# EAGLE design rat2b (EAGLE 7.5.0)
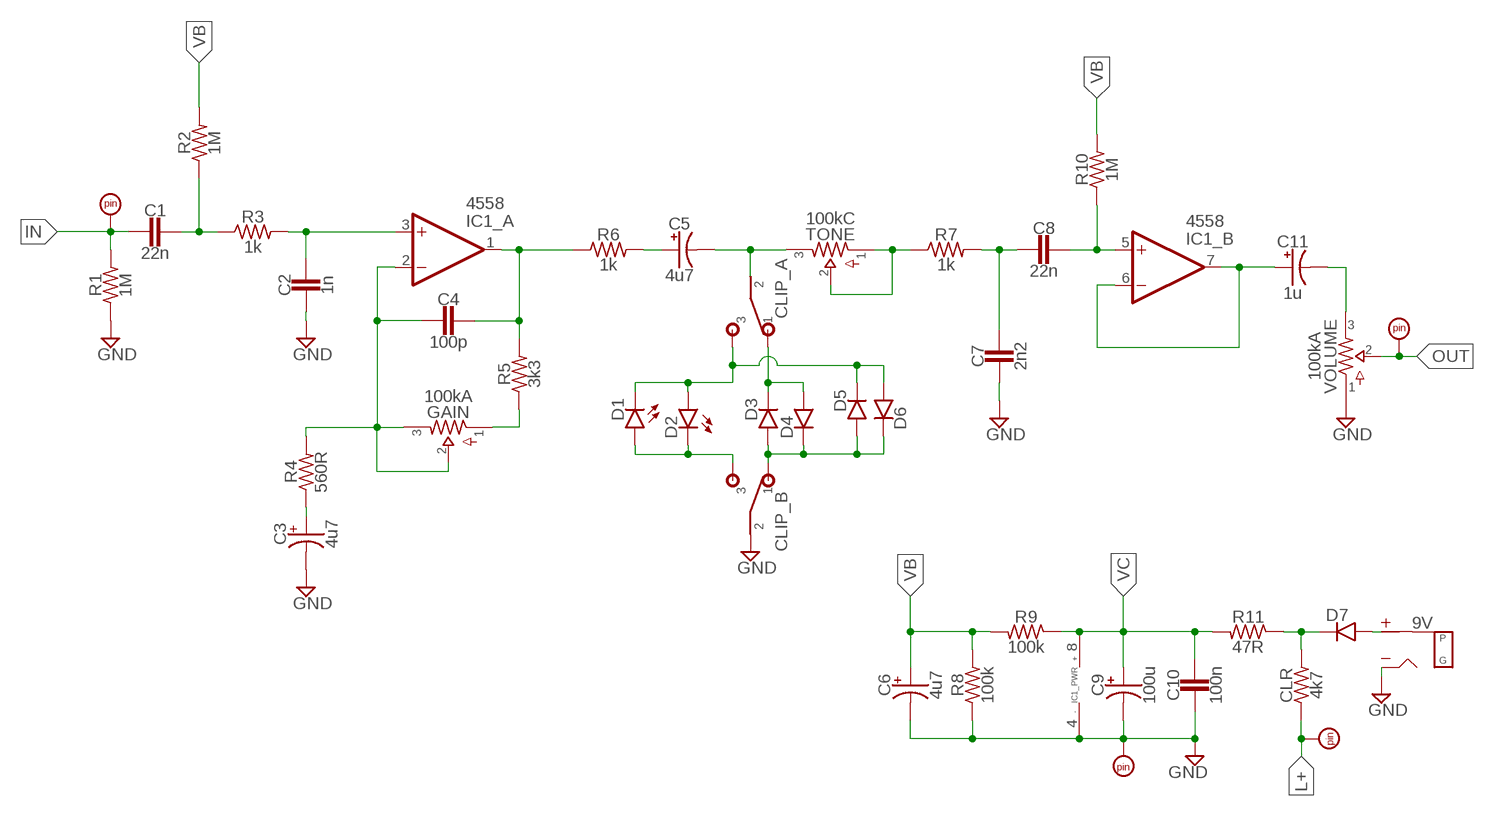
[diagram p0: schematic, sheet 1]

## Parts
9V  DC_MONO  [DC]
C1  22n  CER/FILM2  [050X030_025_2]
C2  1n  CER/FILM2  [050X030_025_2]
C3  4u7  0501  [050_020_1]
C4  100p  CER/FILM2  [050X030_025_2]
C5  4u7  0501  [050_020_1]
C6  4u7  0501  [050_020_1]
C7  2n2  CER/FILM2  [050X030_025_2]
C8  22n  CER/FILM2  [050X030_025_2]
C9  100u  0501  [050_020_1]
C10  100n  CER/FILM2  [050X030_025_2]
C11  1u  0501  [050_020_1]
CLIP  DPDTPCB  [DPDT2_PCB]
CLR  4k7  R_.3B  [R0207/3]
D1  LEDB  [3MM_B]
D2  LEDB  [3MM_B]
D3  DO35.3  [DO35-3]
D4  DO35.3  [DO35-3]
D5  DO35.2  [DO35-2]
D6  DO35.2  [DO35-2]
D7  DO41.3  [DO41-3]
GAIN  100kA  POTS16MM  [16MM]
GND  PADRND  [ROUND]
IC1  4558  DUALTH  [DIL08]
IN  PADSQR  [SQUARE]
LED  PADSQR  [SQUARE]
OUT  PADSQR  [SQUARE]
R1  1M  R_.3B  [R0207/3]
R2  1M  R_.3B  [R0207/3]
R3  1k  R_.3B  [R0207/3]
R4  560R  R_.3B  [R0207/3]
R5  3k3  R_.3B  [R0207/3]
R6  1k  R_.3B  [R0207/3]
R7  1k  R_.3B  [R0207/3]
R8  100k  R_.3B  [R0207/3]
R9  100k  R_.3B  [R0207/3]
R10  1M  R_.3B  [R0207/3]
R11  47R  R_.3B  [R0207/3]
TONE  100kC  POTS16MM  [16MM]
VOLUME  100kA  POTS16MM  [16MM]

## Nets
GND: 9V.S(SLEEVE) C2.2 C3.- C6.- C7.2 C9.- C10.2 CLIP.B2 GND.1 IC1.4(_PWR:V-) R1.1 R8.1 VOLUME.1
IN: C1.2 IN.1 R1.2
L+: CLR.1 CLR.2 D7.C LED.1 R11.1
N$2: C1.1 R2.1 R3.1
N$4: C2.1 IC1.3(_A:+IN) R3.2
N$5: GAIN.1 R5.1
N$6: C4.1 IC1.1(_A:OUT) R5.2 R6.1
N$7: C5.+ R6.2
N$8: C5.- CLIP.A2 TONE.3
N$9: R7.1 TONE.1 TONE.2
N$10: C7.1 C8.2 R7.2
N$11: C8.1 IC1.5(_B:+IN) R10.1
N$12: CLIP.A1 D3.C D4.A
N$13: C11.- VOLUME.3
N$14: CLIP.B1 D3.A D4.C D5.A D6.C
N$15: C4.2 GAIN.2 GAIN.3 IC1.2(_A:-IN) R4.2
N$16: C11.+ IC1.6(_B:-IN) IC1.7(_B:OUT)
N$18: C3.+ R4.1
N$19: 9V.T(TIP) D7.A
N$21: CLIP.A3 D1.K(C) D2.A D5.C D6.A
N$24: CLIP.B3 D1.A D2.K(C)
OUT: OUT.1 VOLUME.2
VB: C6.+ R2.2 R8.2 R9.2 R10.2
VC: C9.+ C10.1 IC1.8(_PWR:V+) R9.1 R11.2

## Library data of the parts
9V = jacks:DC_MONO
C1 C2 C4 C7 C8 C10 = capacitors-film:CER/FILM: 47 - 120pF Xicon Ceramic Disc 2.5mm lead spacing
C3 C5 C6 C9 C11 = capacitors-elec:050: 0.22 - 100uF Xicon values at Mouser.com: 10V: 10 - 100uF; 16V: 2.2 - 47uF; 25V: 0.47 - 47uF; 50V: 0.22 - 22uF
CLIP = switches:DPDT
CLR R1-R11 = resistors:R_
D1 D2 = diodes:LED
D3-D6 = diodes:DO35: DO-35 Package Diodes: 1N914
D7 = diodes:DO41: DO-41 Package Diodes: 1N4001 - 1N40019 Zener Diodes: 1N4728 - 1N4764
GAIN TONE VOLUME = potentiometers:POTS
GND IN LED OUT = supply pins:PAD
IC1 = integrated circuits:DUAL: OP AMP

## Board
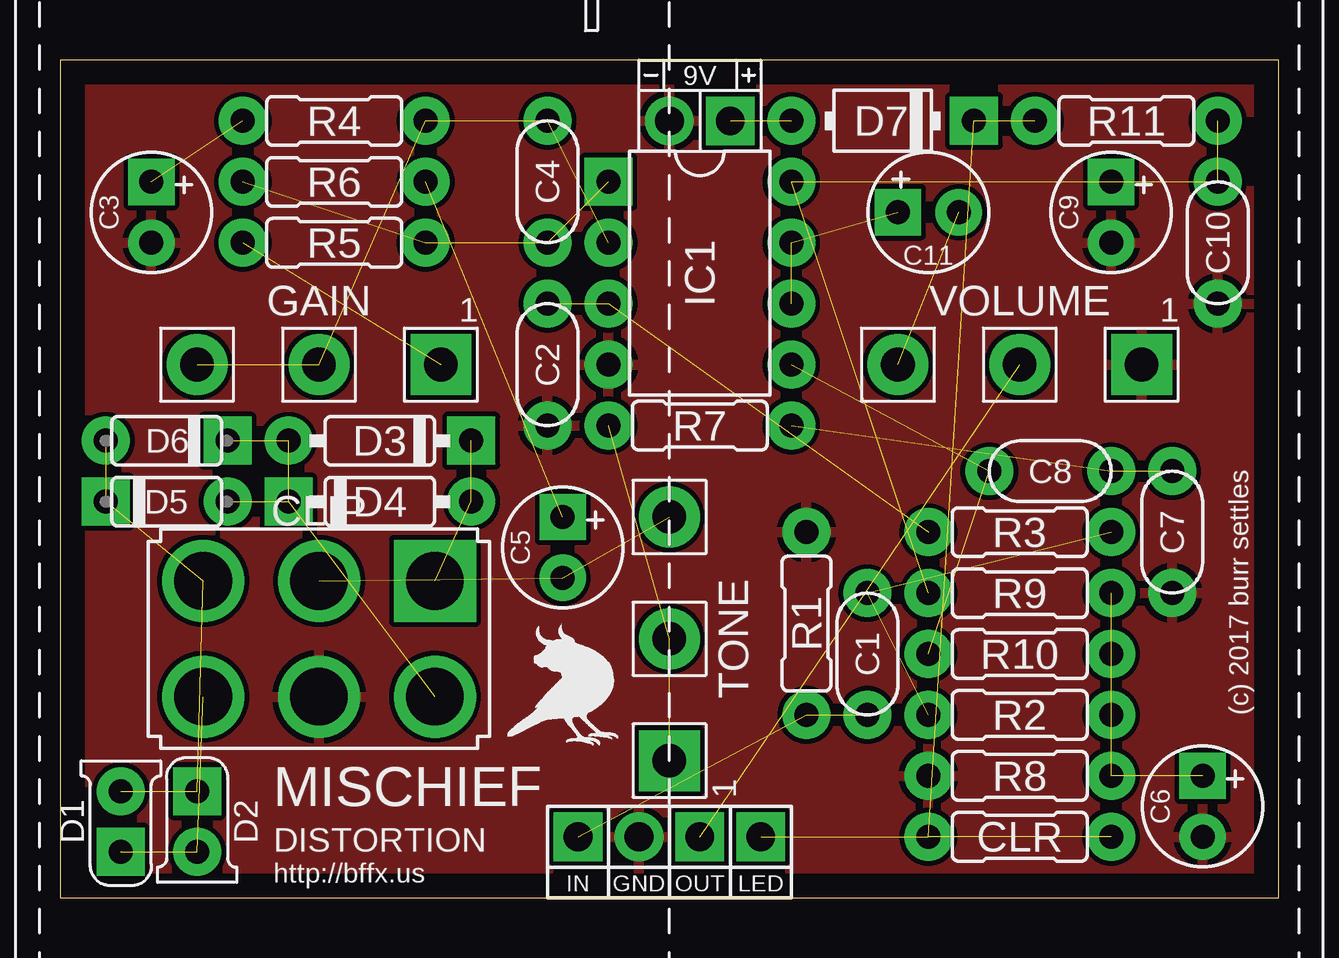
[diagram p1: board, top side]
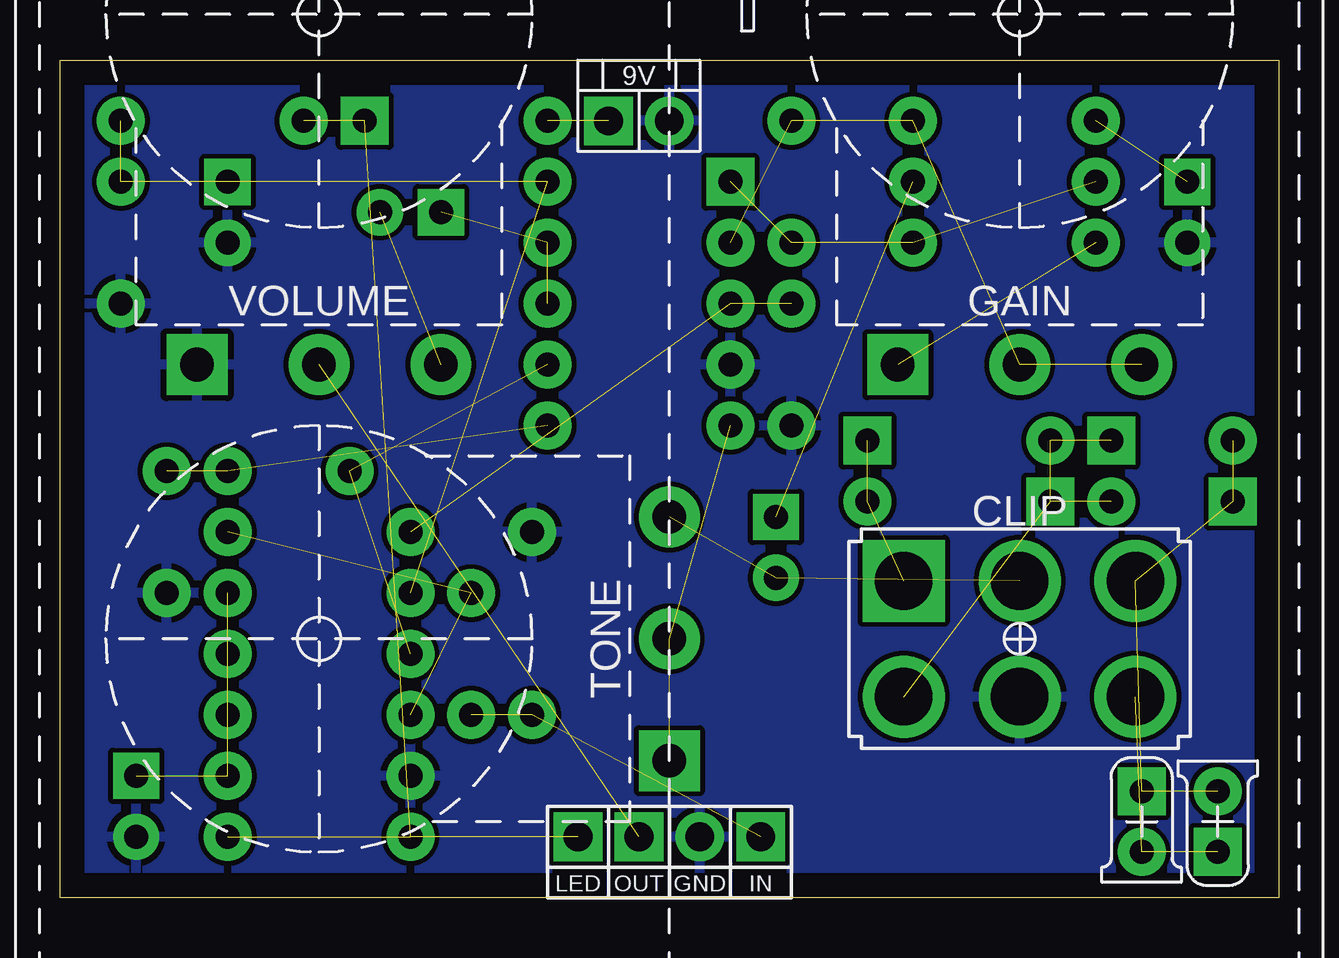
[diagram p2: board, bottom side, seen from below]

Size 50.8 x 34.92 mm. Coordinates in mm from the lower left corner, seen from the top.
Outline: 0,0 50.8,0 50.8,34.92 0,34.91 0,0
Copper layers (1*16): Top 0.035mm / dielectric 1.5mm / Bottom 0.035mm
Design rules "default": minimum track width 10mil, minimum drill 24mil, track to track 8mil, track to pad 8mil, pad to pad 8mil, via to via 8mil, smd to smd 8mil, copper to edge 40mil, drill to drill 8mil, minimum pad ring 10mil, minimum via ring 8mil, stop-mask expansion 4mil, vias tented up to drill 0mil, thermal gap 10mil

### Footprints (pad centres in the part's own frame; a part is rotated, then mirrored left to right if it is on the bottom)
DC = drill 1.2 pad 2.032: S -1.27,0 | drill 1.2 pad 2.032 square: T 1.27,0
050X030_025_2 = drill 1 pad 2: 1 -2.54,0; 2 2.54,0
050_020_1 = drill 1 pad 1.93 square: + -1.27,0 | drill 1 pad 1.93: - 1.27,0
DPDT2_PCB = drill 2.4 square: A1 -2.413,4.834 | drill 2.4: A2 -2.413,0.004; A3 -2.413,-4.826; B1 2.417,4.834; B2 2.417,0.004; B3 2.417,-4.826
R0207/3 = drill 1 pad 2: 1 -3.81,0; 2 3.81,0
3MM_B = drill 1 pad 2 square: A -1.27,0 | drill 1 pad 2: K 1.27,0
DO35-3 = drill 1 pad 2: A 3.81,0 | drill 1 pad 2 square: C -3.81,0
DO35-2 = drill 1 pad 2: A 2.54,0 | drill 1 pad 2 square: C -2.54,0
DO41-3 = drill 1 pad 2: A 3.81,0 | drill 1 pad 2 square: C -3.81,0
16MM = drill 1.4 pad 2.54 square: 1 5.08,0 | drill 1.4 pad 2.54: 2 0,0; 3 -5.08,0
ROUND = drill 1.2 pad 2.032: 1 0,0
DIL08 = drill 1 pad 2 square: 1 -3.81,-3.81 | drill 1 pad 2: 2 -1.27,-3.81; 3 1.27,-3.81; 4 3.81,-3.81; 5 3.81,3.81; 6 1.27,3.81; 7 -1.27,3.81; 8 -3.81,3.81
SQUARE = drill 1.2 pad 2.032 square: 1 0,0

### Placement (x,y rotation side)
9V  26.67,32.38 0 top
C1  33.66,10.16 270 top
C2  20.32,22.23 270 top
C3  3.81,28.57 270 top
C4  20.32,29.84 90 top
C5  20.95,14.61 270 top
C6  47.62,3.81 270 top
C7  46.35,15.24 270 top
C8  41.27,17.78 0 top
C9  43.81,28.57 270 top
C10  48.26,27.3 270 top
C11  36.2,28.57 0 top
CLIP  10.79,10.79 270 top
CLR  40.01,2.54 180 top
D1  2.54,3.17 90 top
D2  5.71,3.17 270 top
D3  13.34,19.05 180 top
D4  13.34,16.51 0 top
D5  4.45,16.51 0 top
D6  4.45,19.05 180 top
D7  34.29,32.38 180 top
GAIN  10.79,22.23 0 top
GND  24.13,2.54 0 top
IC1  26.67,26.04 270 top
IN  21.59,2.54 0 top
LED  29.21,2.54 0 top
OUT  26.67,2.54 0 top
R1  31.11,11.43 270 top
R2  40.01,7.62 0 top
R3  40.01,15.24 180 top
R4  11.43,32.38 0 top
R5  11.43,27.3 0 top
R6  11.43,29.84 0 top
R7  26.67,19.68 0 top
R8  40.01,5.08 0 top
R9  40.01,12.7 0 top
R10  40.01,10.16 0 top
R11  44.45,32.38 0 top
TONE  25.4,10.79 270 top
U$1  [BF0200]  20.95,8.89 0 top
U$2  [1590B]  25.4,-5.08 0 top  (outside the outline)
U$3  [DC_TOP]  25.4,51.44 0 top  (outside the outline)
VOLUME  40.01,22.23 0 top

### Tracks (layer width: path | path; a pad name or v marks a point on that pad's centre or on a via)
GND
  pour Bottom: 0,34.92 50.8,34.92 50.8,0 0,0
  pour Top: 0,34.92 50.8,34.92 50.8,-0.64 0,-0.64
IN  (2 unrouted)
L+  (4 unrouted)
N$2  (2 unrouted)
N$4  (2 unrouted)
N$5  (1 unrouted)
N$6  (3 unrouted)
N$7  (1 unrouted)
N$8  (2 unrouted)
N$9  (2 unrouted)
N$10  (2 unrouted)
N$11  (2 unrouted)
N$12  (2 unrouted)
N$13  (1 unrouted)
N$14  (4 unrouted)
N$15  (4 unrouted)
N$16  (2 unrouted)
N$18  (1 unrouted)
N$19  (1 unrouted)
N$21  (4 unrouted)
N$24  (2 unrouted)
OUT  (1 unrouted)
VB  (4 unrouted)
VC  (4 unrouted)

### Text on the board
tNames: (c) 2017 burr settles | MISCHIEF | DISTORTION | http://bffx.us